# EAGLE schematic Boardv2 (EAGLE 9.3.1)
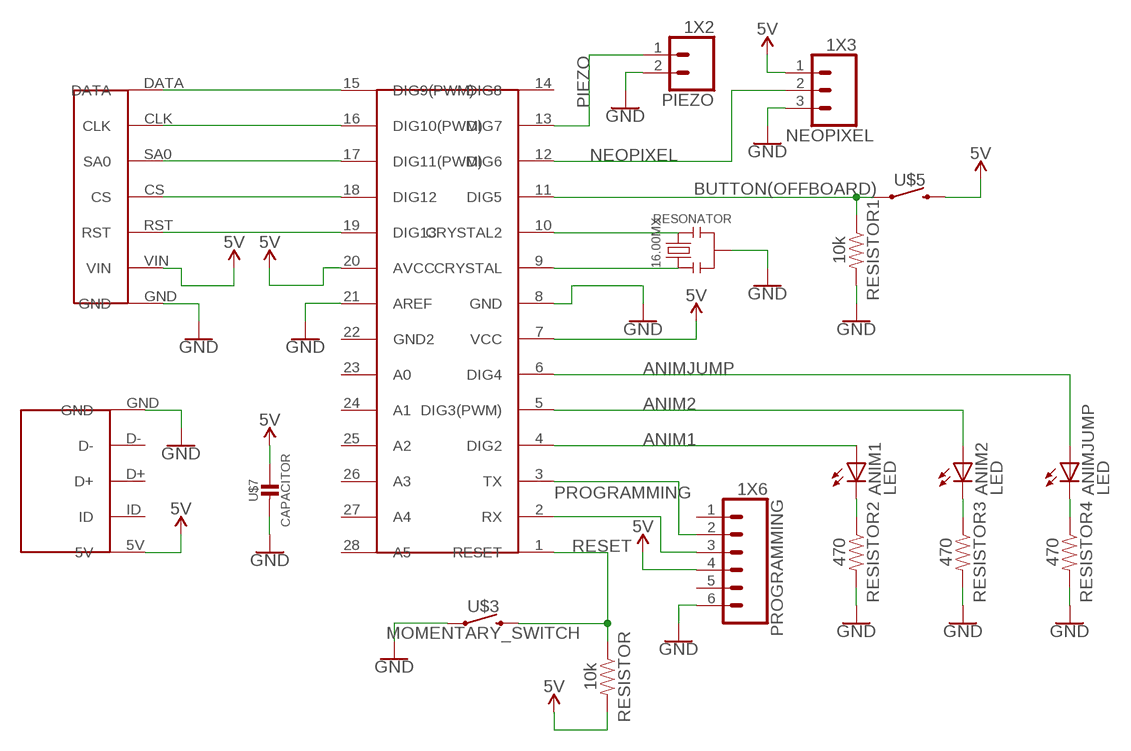
[diagram p0: schematic, sheet 1]

## Parts
16.00MX  RESONATOR  [1X03_NO_SILK]
ANIM1  LED  [1X02_LONGPADS]
ANIM2  LED  [1X02_LONGPADS]
ANIMJUMP  LED  [1X02_LONGPADS]
NEOPIXEL  1X3  [1X03_NO_SILK]
PIEZO  1X2  [1X02_LONGPADS]
PROGRAMMING  1X6  [1X06_NO_SILK]
RESISTOR  10k  RESISTOR  [AXIAL-0.3]
RESISTOR1  10k  RESISTOR  [AXIAL-0.3]
RESISTOR2  470  RESISTOR  [AXIAL-0.3]
RESISTOR3  470  RESISTOR  [AXIAL-0.3]
RESISTOR4  470  RESISTOR  [AXIAL-0.3]
U$1  ATMEGA328  [ATMEGA328]
U$2  USB  [USB]
U$3  MOMENTARY_SWITCH  [TACTILE_SWITCH_PTH_6.0MM]
U$5  BUTTON(OFFBOARD)  [1X02_LONGPADS]
U$6  OLED  [OLED]
U$7  CAPACITOR  [1X02_LONGPADS]

## Nets
5V: NEOPIXEL.1 PROGRAMMING.4 RESISTOR.P$2 U$1.7(VCC) U$1.20(AVCC) U$2.5V U$5.2 U$6.VIN U$7.1
ANIM1: ANIM1.1(A) U$1.4(DIG2)
ANIM2: ANIM2.1(A) U$1.5(DIG3(PWM))
ANIMJUMP: ANIMJUMP.1(A) U$1.6(DIG4)
GND: 16.00MX.2 NEOPIXEL.3 PIEZO.2 PROGRAMMING.6 RESISTOR1.P$2 RESISTOR2.P$2 RESISTOR3.P$2 RESISTOR4.P$2 U$1.8(GND) U$1.21(AREF) U$2.GND U$3.1 U$3.2 U$6.GND U$7.2
N$1: ANIM1.2(C) RESISTOR2.P$1
N$2: ANIM2.2(C) RESISTOR3.P$1
N$3: PROGRAMMING.3 U$1.2(RX)
N$4: ANIMJUMP.2(C) RESISTOR4.P$1
N$5: RESISTOR1.P$1 U$1.11(DIG5) U$5.1
N$6: 16.00MX.1 U$1.9(CRYSTAL)
N$7: 16.00MX.3 U$1.10(CRYSTAL2)
N$8: U$1.15(DIG9(PWM)) U$6.DATA
N$9: U$1.16(DIG10(PWM)) U$6.CLK
N$10: U$1.17(DIG11(PWM)) U$6.SA0
N$11: U$1.18(DIG12) U$6.CS
N$12: U$1.19(DIG13) U$6.RST
NEOPIXEL: NEOPIXEL.2 U$1.12(DIG6)
PIEZO: PIEZO.1 U$1.13(DIG7)
PROGRAMMING: PROGRAMMING.2 U$1.3(TX)
RESET: RESISTOR.P$1 U$1.1(RESET) U$3.3 U$3.4
Unconnected: PROGRAMMING.1 PROGRAMMING.5 U$1.14(DIG8) U$1.22(GND2) U$1.23(A0) U$1.24(A1) U$1.25(A2) U$1.26(A3) U$1.27(A4) U$1.28(A5) U$2.D+ U$2.D- U$2.ID

## Library data of the parts
16.00MX = FroggyRun:RESONATOR
ANIM1 ANIM2 ANIMJUMP = FroggyRun:LED
NEOPIXEL = FroggyRun:1X3
PIEZO = FroggyRun:1X2
PROGRAMMING = FroggyRun:1X6
RESISTOR RESISTOR1-RESISTOR4 = FroggyRun:RESISTOR
U$1 = FroggyRun:ATMEGA328
U$2 = FroggyRun:USB
U$3 = FroggyRun:MOMENTARY_SWITCH
U$5 = FroggyRun:BUTTON(OFFBOARD)
U$6 = FroggyRun:OLED
U$7 = FroggyRun:CAPACITOR

## Net classes
0 default: width 0.762 mm